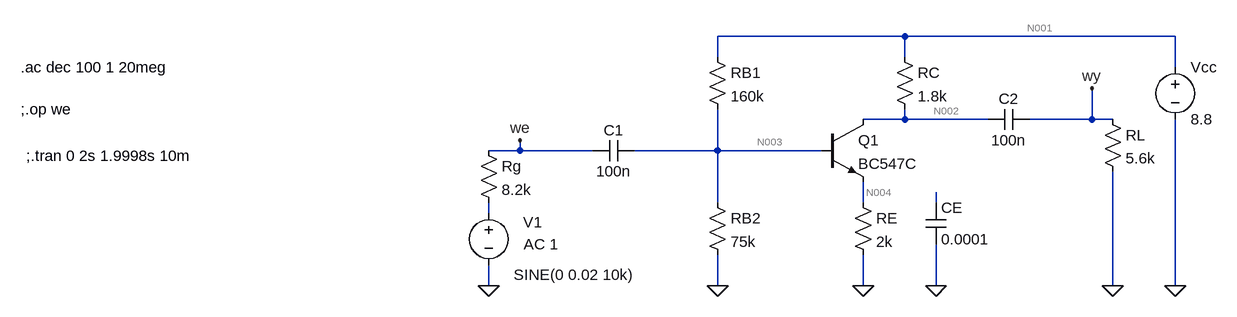
[diagram p0: schematic symulacja.asc]
symulacja.asc, the LTspice schematic file:
Version 4
SHEET 1 880 680
WIRE 288 16 0 16
WIRE 704 16 288 16
WIRE 0 48 0 16
WIRE 288 48 288 16
WIRE 704 64 704 16
WIRE 288 144 288 128
WIRE 288 144 224 144
WIRE 416 144 288 144
WIRE 576 144 576 96
WIRE 576 144 480 144
WIRE 608 144 576 144
WIRE -304 192 -304 176
WIRE -304 192 -352 192
WIRE -192 192 -304 192
WIRE 0 192 0 128
WIRE 0 192 -128 192
WIRE 160 192 0 192
WIRE 0 272 0 192
WIRE 224 272 224 240
WIRE 336 272 336 256
WIRE -352 288 -352 272
WIRE -352 400 -352 368
WIRE 0 400 0 352
WIRE 224 400 224 352
WIRE 336 400 336 336
WIRE 608 400 608 224
WIRE 704 400 704 144
FLAG -352 400 0
FLAG 0 400 0
FLAG 224 400 0
FLAG 608 400 0
FLAG 336 400 0
FLAG 704 400 0
FLAG 576 96 wy
FLAG -304 176 we
SYMBOL npn 160 144 R0
SYMATTR InstName Q1
SYMATTR Value BC547C
SYMBOL res -368 176 R0
SYMATTR InstName Rg
SYMATTR Value 8.2k
SYMBOL res -16 256 R0
SYMATTR InstName RB2
SYMATTR Value 75k
SYMBOL res -16 32 R0
SYMATTR InstName RB1
SYMATTR Value 160k
SYMBOL res 272 32 R0
SYMATTR InstName RC
SYMATTR Value 1.8k
SYMBOL res 208 256 R0
SYMATTR InstName RE
SYMATTR Value 2k
SYMBOL res 592 128 R0
SYMATTR InstName RL
SYMATTR Value 5.6k
SYMBOL cap -128 176 R90
WINDOW 0 0 32 VBottom 2
WINDOW 3 32 32 VTop 2
SYMATTR InstName C1
SYMATTR Value 100n
SYMBOL cap 480 128 R90
WINDOW 0 0 32 VBottom 2
WINDOW 3 32 32 VTop 2
SYMATTR InstName C2
SYMATTR Value 100n
SYMBOL cap 320 272 R0
SYMATTR InstName CE
SYMATTR Value 0.0001
SYMBOL voltage -352 272 R0
WINDOW 3 38 111 Left 2
WINDOW 123 54 64 Left 2
WINDOW 39 0 0 Left 0
WINDOW 0 53 30 Left 2
SYMATTR Value SINE(0 0.02 10k)
SYMATTR Value2 AC 1
SYMATTR InstName V1
SYMBOL voltage 704 48 R0
SYMATTR InstName Vcc
SYMATTR Value 8.8
TEXT -1072 128 Left 2 !;.op we
TEXT -1064 200 Left 2 !;.tran 0 2s 1.9998s 10m
TEXT -1072 64 Left 2 !.ac dec 100 1 20meg

The netlist it stands for:
* symulacja.asc
Q1 N002 N003 N004 0 BC547C
Rg we N006 8.2k
RB2 N003 0 75k
RB1 N001 N003 160k
RC N001 N002 1.8k
RE N004 0 2k
RL wy 0 5.6k
C1 N003 we 100n
C2 wy N002 100n
CE N005 0 0.0001
V1 N006 0 SINE(0 0.02 10k) AC 1
Vcc N001 0 8.8
.model NPN NPN
.model PNP PNP
.lib standard.bjt
;.op we
;.tran 0 2s 1.9998s 10m
.ac dec 100 1 20meg
.backanno
.end

* Results of the author's LTspice run, read from the files saved beside the schematic
* Operating Point, zero values left out:
*   V(n002) = 6.932 V
*   V(n003) = 2.7 V
*   V(n004) = 2.079 V
*   V(n001) = 8.8 V
*   Ic(Q1) = 1.038 mA
*   Ib(Q1) = 2.122 µA
*   Ie(Q1) = -1.04 mA
*   I(Re) = 1.04 mA
*   I(Rc) = 1.038 mA
*   I(Rb1) = 38.12 µA
*   I(Rb2) = 36 µA
*   I(Vcc) = -1.076 mA
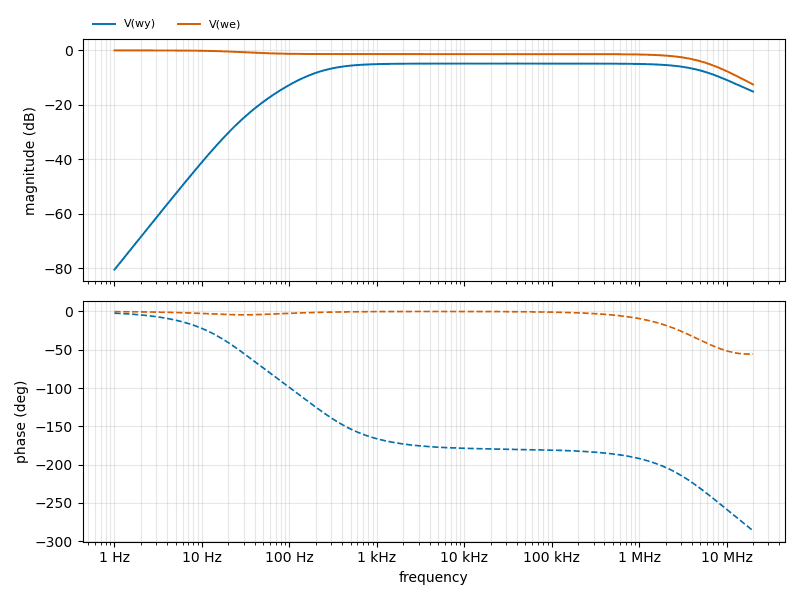
[diagram p1: AC Analysis of symulacja.asc, plotted from the saved traces]
* AC Analysis, 1 run:
*   V(wy): -80.47 dB at 1 Hz, -15.09 dB at 20 MHz, peak -4.83 dB at 34.67 kHz, 3 dB below the peak at 218.7 Hz and 5.606 MHz
*   V(we): -0.00 dB at 1 Hz, -12.50 dB at 20 MHz, peak -0.00 dB at 1 Hz, 3 dB below the peak at 3.733 MHz